# EAGLE schematic TopSolarPanel (EAGLE 6.6.0)
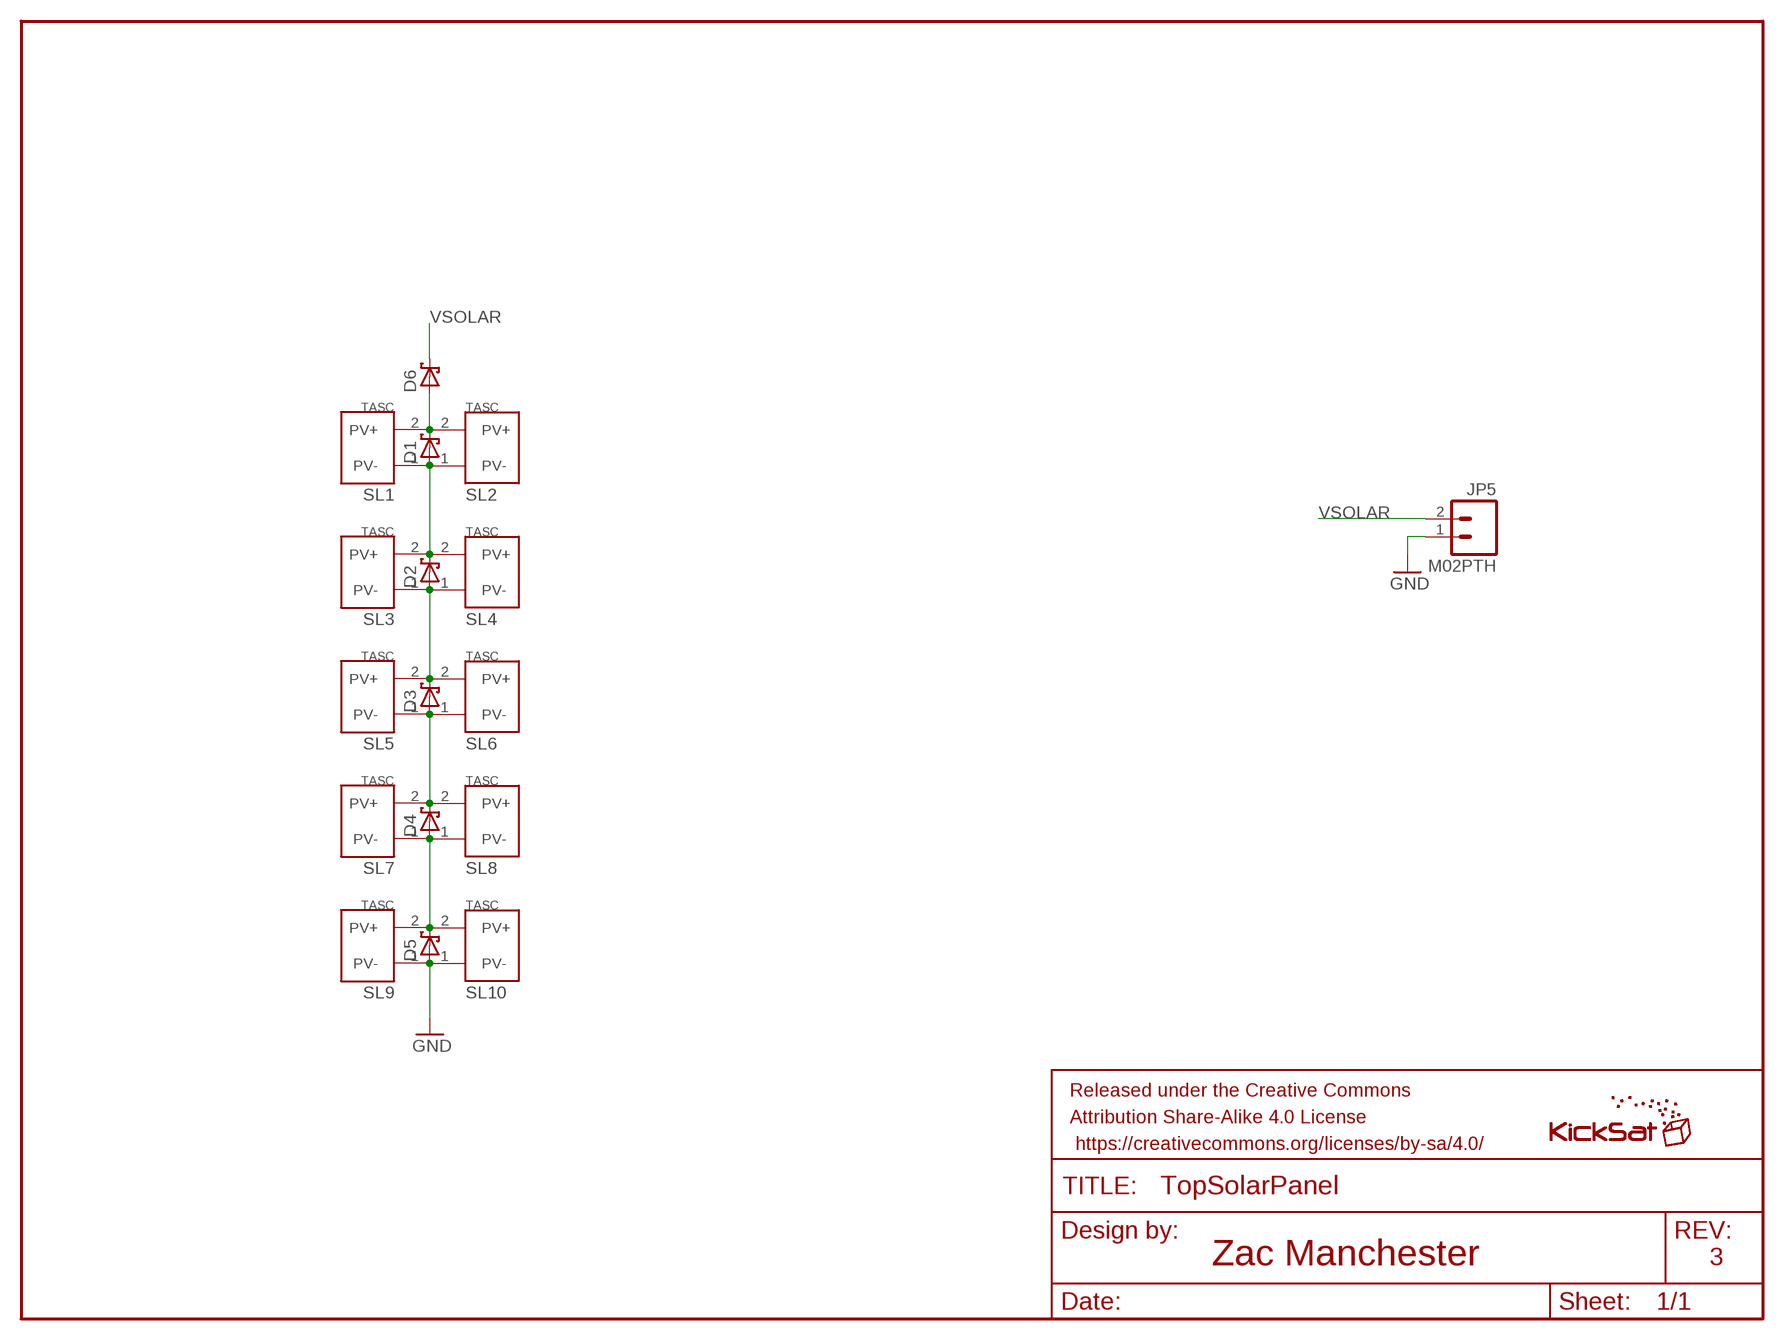
[diagram p0: schematic, sheet 1]

## Parts
D1  SB_DIODE  [SB_DIODE]
D2  SB_DIODE  [SB_DIODE]
D3  SB_DIODE  [SB_DIODE]
D4  SB_DIODE  [SB_DIODE]
D5  SB_DIODE  [SB_DIODE]
D6  SB_DIODE  [SB_DIODE]
FRAME1  FRAME-LETTER  [CREATIVE_COMMONS]
JP5  M02PTH  [1X02]
SL1  SOLAR_CELL  [SOLAR_CELL]
SL2  SOLAR_CELL  [SOLAR_CELL]
SL3  SOLAR_CELL  [SOLAR_CELL]
SL4  SOLAR_CELL  [SOLAR_CELL]
SL5  SOLAR_CELL  [SOLAR_CELL]
SL6  SOLAR_CELL  [SOLAR_CELL]
SL7  SOLAR_CELL  [SOLAR_CELL]
SL8  SOLAR_CELL  [SOLAR_CELL]
SL9  SOLAR_CELL  [SOLAR_CELL]
SL10  SOLAR_CELL  [SOLAR_CELL]
U$1  KICKSAT_LOGO  [KICKSAT_LOGO]

## Nets
GND: D5.POS JP5.1 SL9.1(PV-) SL10.1(PV-)
N$9: D1.NEG D6.POS SL1.2(PV+) SL2.2(PV+)
N$37: D2.POS D3.NEG SL3.1(PV-) SL4.1(PV-) SL5.2(PV+) SL6.2(PV+)
N$39: D3.POS D4.NEG SL5.1(PV-) SL6.1(PV-) SL7.2(PV+) SL8.2(PV+)
N$45: D1.POS D2.NEG SL1.1(PV-) SL2.1(PV-) SL3.2(PV+) SL4.2(PV+)
N$50: D4.POS D5.NEG SL7.1(PV-) SL8.1(PV-) SL9.2(PV+) SL10.2(PV+)
VSOLAR: D6.NEG JP5.2

## Notes on the sheet
- Zac Manchester | 3

## Library data of the parts
D1-D6 = Solar:SB_DIODE
FRAME1 = SparkFun-Aesthetics:FRAME-LETTER: Schematic Frame Standard 8.5x11 US Letter frame
JP5 = SparkFun-Connectors:M02: Standard 2-pin 0.1" header. Use with - straight break away headers ( PRT-00116) - right angle break away headers (PRT-00553) - swiss pins (PRT-00743) - machine pins (PRT-00117) - female headers (PRT-00115) Molex polarized connector foot print use with: PRT-08233 with associated crimp pins and housings. 2.54_SCREWTERM for use with PRT-10571. 3.5mm Screw Terminal footprints for PRT-08084 5mm Screw Terminal footprints for use with PRT-08433
SL1-SL10 = Solar:SOLAR_CELL
U$1 = KickSat-Logo:KICKSAT_LOGO